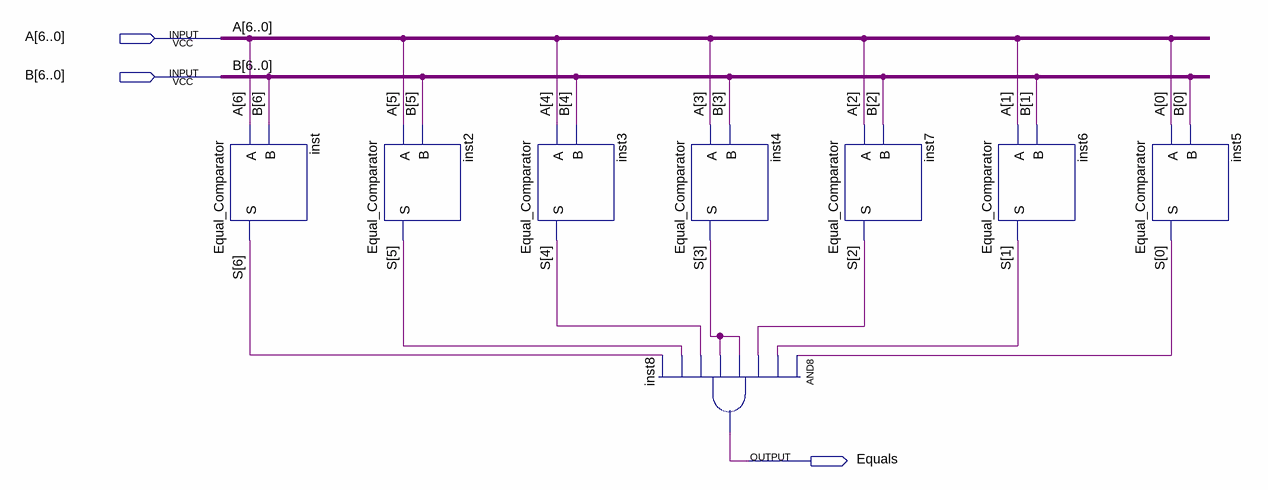
[diagram p0: schematic sheet]
// Quartus schematic Seven_bit_Equal_Comparator.bdf as structural Verilog: 8 symbols, 3 pins
module Seven_bit_Equal_Comparator (
  input  [6:0] A,
  input  [6:0] B,
  output Equals
);

  wire [6:0] S;

  Equal_Comparator inst (.A(A[6]), .B(B[6]), .S(S[6]));
  Equal_Comparator inst2 (.A(A[5]), .B(B[5]), .S(S[5]));
  Equal_Comparator inst3 (.A(A[4]), .B(B[4]), .S(S[4]));
  Equal_Comparator inst4 (.A(A[3]), .B(B[3]), .S(S[3]));
  and inst8 (Equals, S[0], S[1], S[2], S[3], S[3], S[4], S[5], S[6]);
  Equal_Comparator inst7 (.A(A[2]), .B(B[2]), .S(S[2]));
  Equal_Comparator inst6 (.A(A[1]), .B(B[1]), .S(S[1]));
  Equal_Comparator inst5 (.A(A[0]), .B(B[0]), .S(S[0]));
endmodule
